# Altium schematic sheet Sheet_1_2022-02-14.schdoc
size 172 x 102 mm
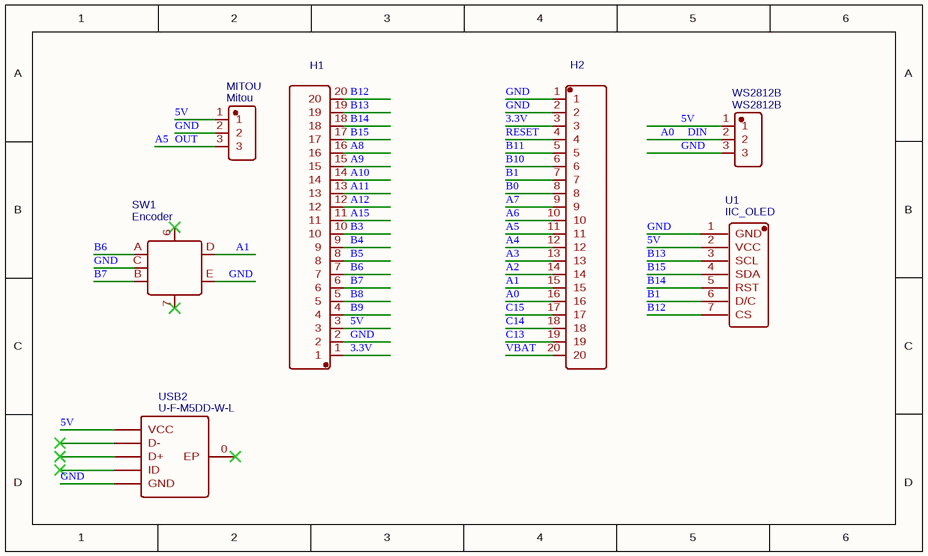
[diagram p0: Sheet_1_2022-02-14.schdoc]

## Parts
H1  210S-1*20P L=11.6MMGold-plated black  [HDR-TH_20P-P2.54-V-M-1]  (value not drawn)
H2  210S-1*20P L=11.6MMGold-plated black  [HDR-TH_20P-P2.54-V-M-1]  (value not drawn)
MITOU  Mitou  [HDR-TH_3P-P2.54-V-M-1]
SW1  Encoder  [SW-TH_EC11E09444A8]
U1  IIC_OLED  [IIC_OLED]
USB2  U-F-M5DD-W-L  [MICRO-USB-SMD_MICRO-USB-18]
WS2812B  WS2812B  [HDR-TH_3P-P2.54-V-M-1]

## Nets
3.3V: H1.1 H2.3
5V: H1.3 MITOU.1 U1.2(VCC) USB2.1(VCC) WS2812B.1
A0: H2.16 WS2812B.2  [also labelled DIN]
A1: H2.15 SW1.D
A2: H2.14
A3: H2.13
A4: H2.12
A5: H2.11 MITOU.3  [also labelled OUT]
A6: H2.10
A7: H2.9
A8: H1.16
A9: H1.15
A10: H1.14
A11: H1.13
A12: H1.12
A15: H1.11
B0: H2.8
B1: H2.7 U1.6(D/C)
B3: H1.10
B4: H1.9
B5: H1.8
B6: H1.7 SW1.A
B7: H1.6 SW1.B
B8: H1.5
B9: H1.4
B10: H2.6
B11: H2.5
B12: H1.20 U1.7(CS)
B13: H1.19 U1.3(SCL)
B14: H1.18 U1.5(RST)
B15: H1.17 U1.4(SDA)
C13: H2.19
C14: H2.18
C15: H2.17
GND: H1.2 H2.1 H2.2 MITOU.2 SW1.C SW1.E U1.1(GND) USB2.5(GND) WS2812B.3
RESET: H2.4
VBAT: H2.20

Not connected (* = marked no-connect by the designer): SW1 6(EH)* 7(EH)*; USB2 0(EP)* 2(D-)* 3(D+)* 4(ID)*

## Library data of the parts
H1 H2 = 210S-1*20P L=11.6MMGold-plated black: BOM_Manufacturer: Ckmtw; Contributor: LCSC; BOM_Supplier: LCSC; BOM_Manufacturer Part: 210S-1*20P L=11.6MMGold-plated black; BOM_Supplier Part: C124374; BOM_JLCPCB Part Class: Extended Part; spicePre: H; spiceSymbolName: 210S-1*20P L=11.6MMGold-plated black
MITOU = Mitou: BOM_Manufacturer: ZHENGLING; BOM_Manufacturer Part: Z-211-0311-0021-001; Contributor: LCSC; BOM_Supplier: LCSC; BOM_Supplier Part: C152153; BOM_JLCPCB Part Class: Extended Part; spicePre: H; spiceSymbolName: Z-211-0311-0021-001
SW1 = Encoder: BOM_Manufacturer: ALPSALPINE; BOM_Manufacturer Part: EC11E09444A8; Contributor: LCSC; BOM_Supplier: LCSC; BOM_Supplier Part: C1322538; spicePre: S; spiceSymbolName: EC11E09444A8
U1 = IIC_OLED: Contributor: ccm1668447214; spicePre: U; spiceSymbolName: IIC_OLED
USB2 = U-F-M5DD-W-L: BOM_Manufacturer: HRO; Contributor: LCSC; BOM_Supplier: LCSC; BOM_Manufacturer Part: U-F-M5DD-W-L; BOM_Supplier Part: C145792; BOM_JLCPCB Part Class: Extended Part; spicePre: U; spiceSymbolName: U-F-M5DD-W-L
WS2812B = WS2812B: BOM_Manufacturer: ZHENGLING; BOM_Manufacturer Part: Z-211-0311-0021-001; Contributor: LCSC; BOM_Supplier: LCSC; BOM_Supplier Part: C152153; BOM_JLCPCB Part Class: Extended Part; spicePre: H; spiceSymbolName: Z-211-0311-0021-001